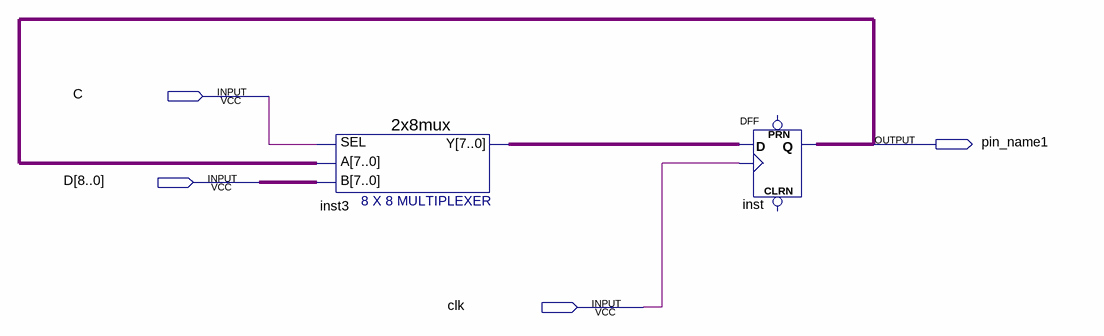
[diagram p0: schematic sheet]
// Quartus schematic reg_para.bdf as structural Verilog: 2 symbols, 4 pins
module reg_para (
  input  C,
  input  [8:0] D,
  input  clk,
  output pin_name1
);

  wire [7:0] inst3_y, inst_q;

  \2x8mux  inst3 (.SEL(C), .A(inst_q), .B(D), .Y(inst3_y));
  DFF inst[7:0] (.CLK(clk), .D(inst3_y), .Q(inst_q));  // open: CLRN, PRN
endmodule
